# EAGLE design key (EAGLE 9.6.2)
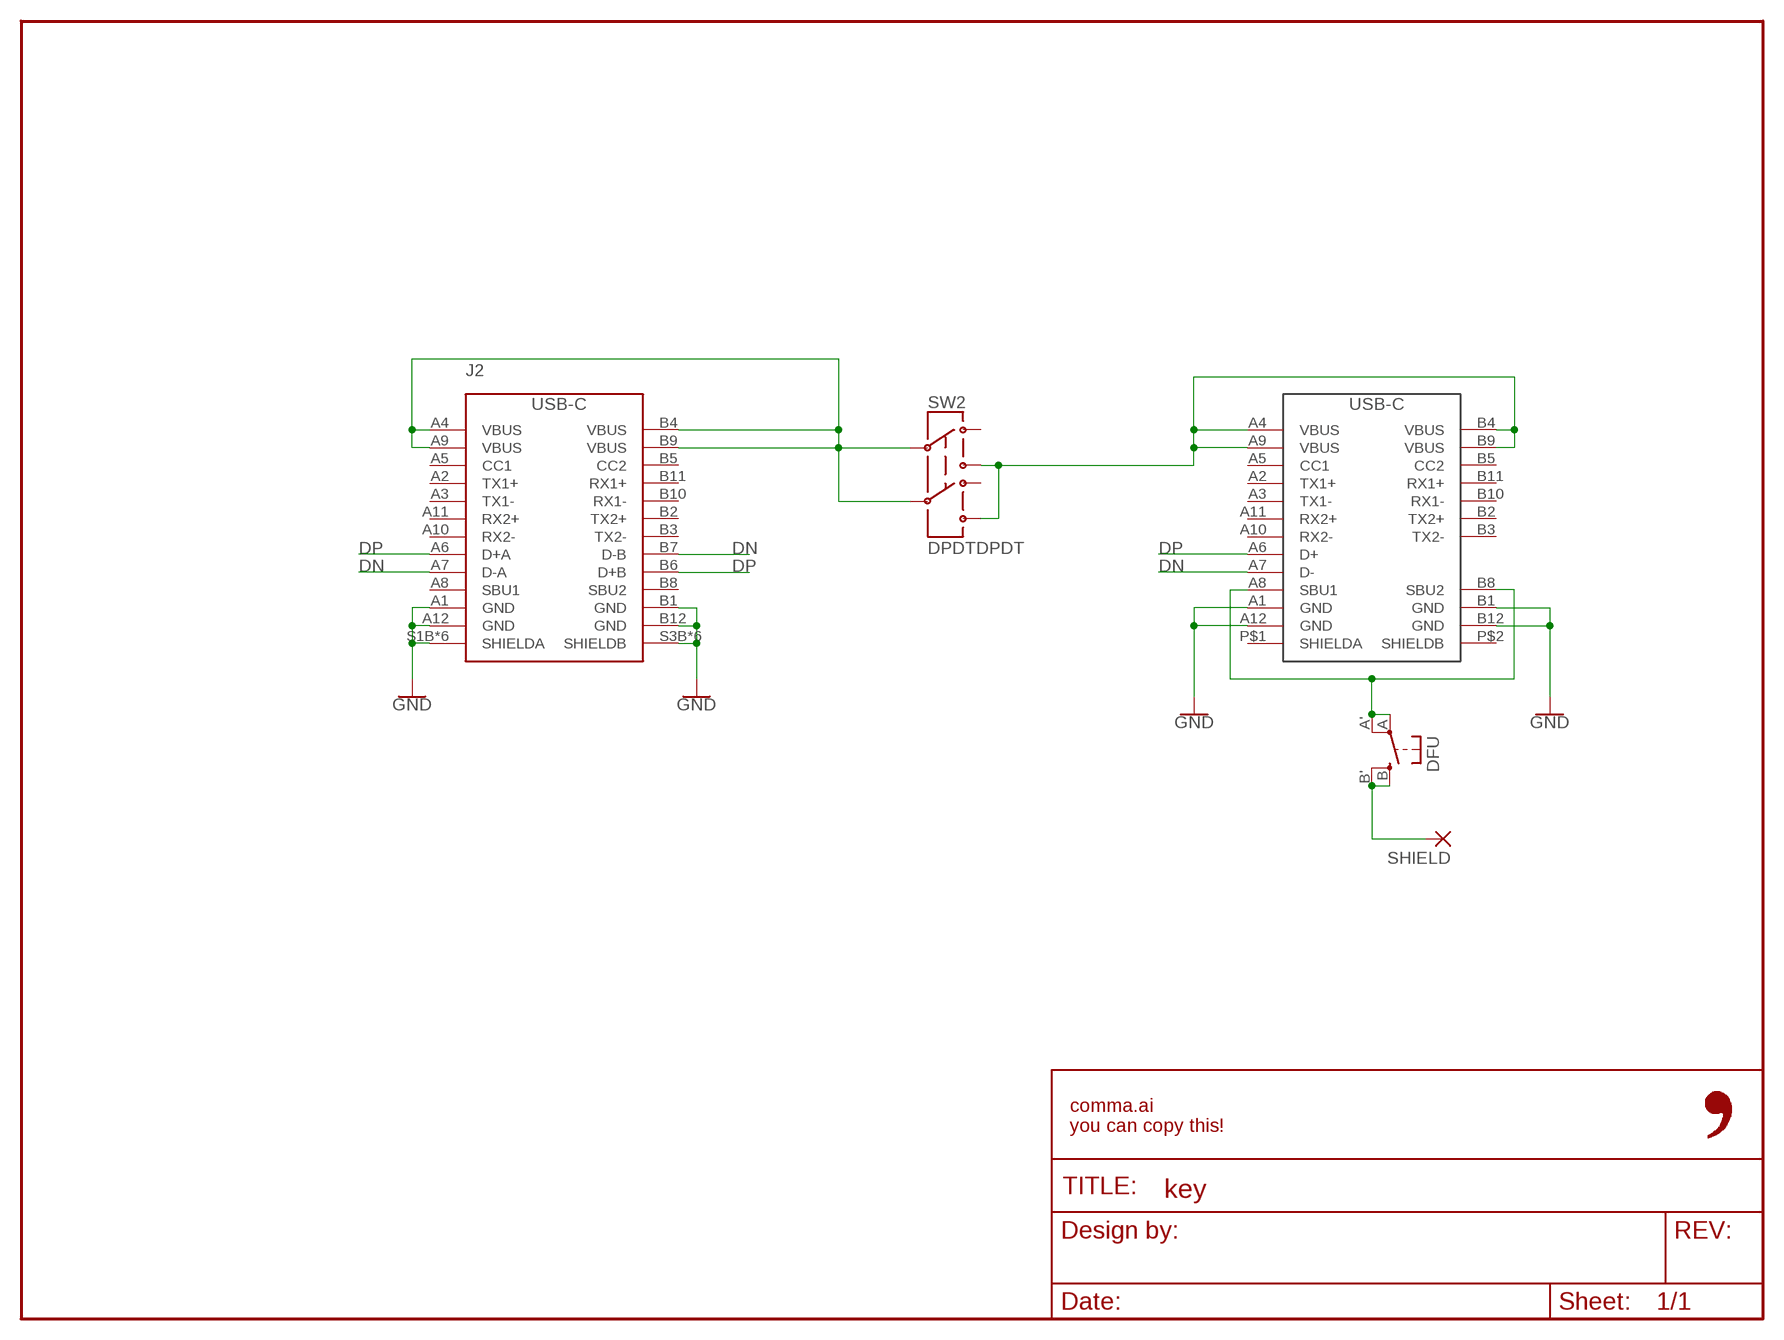
[diagram p0: schematic, sheet 1]

## Parts
DFU  SPST-2-4PIN  [EVQ-Q2]
FRAME1  FRAME-LETTER-OPENNO_PACKAGE  [DUMMY]
J1  USB-C  [USB-C]
J2  USB-C-FEMALE  [DX07S024XJ1R1100]
SHIELD  1,6/0,8  [1,6/0,8]
SW2  DPDTDPDT  [AYZ0202]

## Nets
DN: J1.A7(D-) J2.A7(D-A) J2.B7(D-B)
DP: J1.A6(D+) J2.A6(D+A) J2.B6(D+B)
GND: J1.A1(GND) J1.A12(GND) J1.B1(GND) J1.B12(GND) J2.A1(GND) J2.A12(GND) J2.B1(GND) J2.B12(GND) J2.S1B(SHIELDA) J2.S1T(SHIELDA) J2.S1TH(SHIELDA) J2.S2B(SHIELDA) J2.S2T(SHIELDA) J2.S2TH(SHIELDA) J2.S3B(SHIELDB) J2.S3T(SHIELDB) J2.S3TH(SHIELDB) J2.S4B(SHIELDB) J2.S4T(SHIELDB) J2.S4TH(SHIELDB)
N$2: J1.A4(VBUS) J1.A9(VBUS) J1.B4(VBUS) J1.B9(VBUS) SW2.3 SW2.6
N$3: DFU.A'(P1) DFU.A(P) J1.A8(SBU1) J1.B8(SBU2)
N$4: DFU.B'(S1) DFU.B(S) SHIELD.1(P)
N$5: J2.A4(VBUS) J2.A9(VBUS) J2.B4(VBUS) J2.B9(VBUS) SW2.2 SW2.5
Unconnected: J1.A2(TX1+) J1.A3(TX1-) J1.A5(CC1) J1.A10(RX2-) J1.A11(RX2+) J1.B2(TX2+) J1.B3(TX2-) J1.B5(CC2) J1.B10(RX1-) J1.B11(RX1+) J1.P$1(SHIELDA) J1.P$2(SHIELDB) J2.A2(TX1+) J2.A3(TX1-) J2.A5(CC1) J2.A8(SBU1) J2.A10(RX2-) J2.A11(RX2+) J2.B2(TX2+) J2.B3(TX2-) J2.B5(CC2) J2.B8(SBU2) J2.B10(RX1-) J2.B11(RX1+) SW2.1 SW2.4

## Library data of the parts
DFU = comma.ai:SPST-2; MPN: EVQ-Q2Y03W
FRAME1 = comma.ai:FRAME-LETTER-OPEN: Schematic Frame - Letter Standard 8.5x11 US Letter frame; DESIGNER: Nobody; VERSION: v01
J1 = comma.ai:USB-C; MPN: 10544440001
J2 = comma.ai:USB-C-FEMALE; MPN: DX07S024XJ1R1100
SHIELD = wirepad:1,6/0,8: THROUGH-HOLE PAD
SW2 = comma.ai:DPDT; MPN: JS202011SCQN

## Board
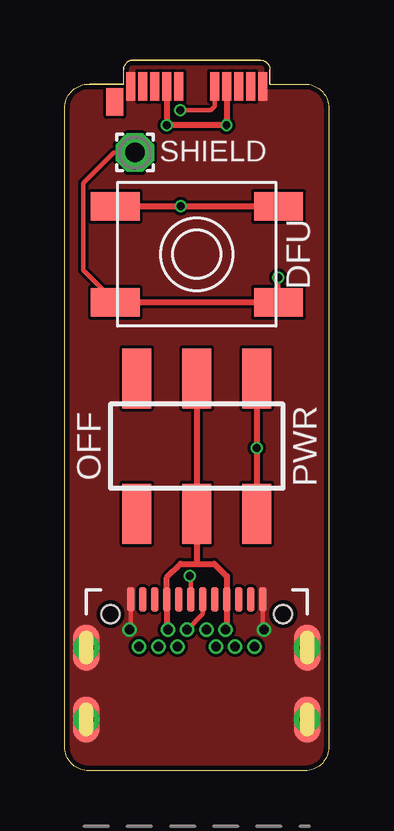
[diagram p1: board, top side]
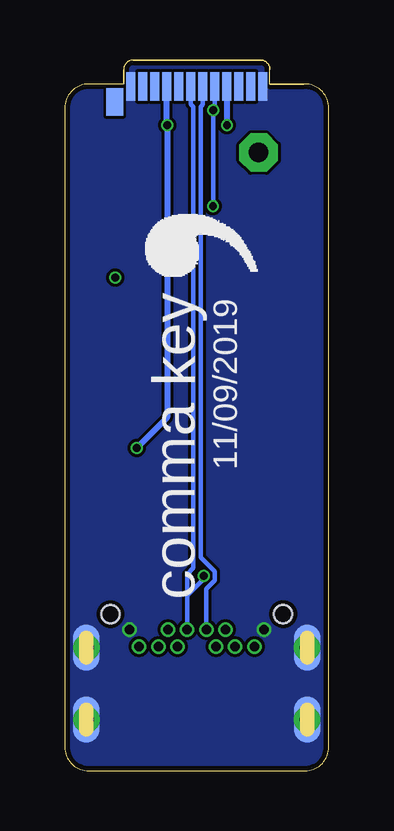
[diagram p2: board, bottom side, seen from below]

Size 11 x 29.64 mm. Coordinates in mm from the lower left corner, seen from the top.
Outline: 11,27.64 11,1 arc-90 10,0 1,0 arc-90 0,1 0,27.64 arc-90 1,28.64 2.45,28.64 2.45,29.24 arc-90 2.85,29.64 8.14,29.64 arc-90 8.54,29.24 8.54,28.64 10,28.64 arc-90 11,27.64
Copper layers (1*16): Top 0.035mm / dielectric 1.5mm / Bottom 0.035mm
Design rules "jlcpcb_2layer": minimum track width 5mil, minimum drill 12mil, track to track 5mil, track to pad 5mil, pad to pad 5mil, via to via 5mil, smd to smd 5mil, copper to edge 8mil, drill to drill 8mil, minimum pad ring 3mil, minimum via ring 3mil, stop-mask expansion 4mm, vias tented up to drill 20mil, thermal gap 10mil

### Footprints (pad centres in the part's own frame; a part is rotated, then mirrored left to right if it is on the bottom)
EVQ-Q2 = smd 2.032 x 1.2: A -3.4,-2; A' 3.4,-2; B -3.4,2; B' 3.4,2
USB-C = smd 0.38 x 1.2: A1 -2.75,0; A2 -2.25,0; A3 -1.75,0; A4 -1.25,0; A5 -0.75,0; A6 -0.25,0; A7 0.25,0; A8 0.75,0; A9 1.25,0; A10 1.75,0; A11 2.25,0; A12 2.75,0 | smd 0.38 x 1.2 bottom: B1 2.75,0; B2 2.25,0; B3 1.75,0; B4 1.25,0; B5 0.75,0; B8 -0.75,0; B9 -1.25,0; B10 -1.75,0; B11 -2.25,0; B12 -2.75,0 | smd 0.7 x 1.15: P$1 -3.42,-0.65 | smd 0.7 x 1.15 bottom: P$2 3.42,-0.65
DX07S024XJ1R1100 = smd 0.3 x 1: A1 -2.75,0.61; A2 -2.25,0.61; A3 -1.75,0.61; A4 -1.25,0.61; A5 -0.75,0.61; A6 -0.25,0.61; A7 0.25,0.61; A8 0.75,0.61; A9 1.25,0.61; A10 1.75,0.61; A11 2.25,0.61; A12 2.75,0.61 | drill 0.4 pad 0.6: B1 2.8,-0.65; B2 2.4,-1.35; B3 1.6,-1.35; B4 1.2,-0.65; B5 0.8,-1.35; B6 0.4,-0.65; B7 -0.4,-0.65; B8 -0.8,-1.35; B9 -1.2,-0.65; B10 -1.6,-1.35; B11 -2.4,-1.35; B12 -2.8,-0.65 | smd 1.1 x 1.9 bottom: S1B -4.6,-1.4; S2B -4.6,-4.4; S3B 4.6,-4.4; S4B 4.6,-1.4 | smd 1.1 x 1.9: S1T -4.6,-1.4; S2T -4.6,-4.4; S3T 4.6,-4.4; S4T 4.6,-1.4 | drill 0.6 pad 1.1: S1TH -4.6,-1.4; S2TH -4.6,-4.4; S3TH 4.6,-4.4; S4TH 4.6,-1.4 | hole 0.75: -3.6,0; 3.6,0
1,6/0,8 = drill 0.813 pad 1.6 octagon: 1 0,0
AYZ0202 = smd 1.2 x 2.5: 1 -2.5,2.825; 2 0,2.825; 3 2.5,2.825; 4 -2.5,-2.825; 5 0,-2.825; 6 2.5,-2.825

### Placement (x,y rotation side)
DFU  5.5,21.54 180 top
FRAME1  -0.64,-2.41 0 top
J1  5.5,28.54 0 bottom
J2  5.5,6.54 0 top
SHIELD  2.92,25.78 0 top
SW2  5.5,13.54 0 top
U$1  [LOGO]  2.67,19.94 90 bottom

### Tracks (layer width: path | path; a pad name or v marks a point on that pad's centre or on a via)
DN
  Top 0.178: J2.A7 5.75,6.54 J2.B7
  Bottom 0.178: J1.A7 5.25,27.77 5.33,27.69 5.33,8.91 4.74,8.32 4.74,7.94 5.1,7.58 J2.B7
DP  (via drill 0.33)
  Top 0.178: J2.A6 5.25,8.09 v5.21,8.13
  Bottom 0.178: v5.21,8.13 5.21,8 5.9,7.31 | 5.9,7.31 J2.B6 | J1.A6 5.75,27.8 5.64,27.69 5.64,8.46 5.9,8.2 5.9,7.31
GND
  Top 0.178: J2.A1 2.75,5.94 J2.B12 | J2.A12 8.25,5.94 J2.B1
  pour Bottom (no thermals): -0.51,30.48 12.95,30.48 12.95,-0.76 -0.51,-0.76
  pour Top (no thermals): -0.64,30.73 13.34,30.73 13.34,-0.89 -0.64,-0.89
N$2  (via drill 0.33)
  Top 0.254: SW2.3 v8,13.46 SW2.6 | J1.B4 4.25,26.93 v4.24,26.92 v6.74,26.92 6.75,26.94 J1.B9
  Bottom 0.254: J1.B4 4.25,26.93 v4.24,26.92 | J1.B9 6.75,26.94 v6.74,26.92 6.74,14.73 v8,13.46
N$3  (via drill 0.33)
  Top 0.178: J1.B8 6.25,27.71 6.09,27.55 v4.82,27.55
  Top 0.254: DFU.A' v4.83,23.54 DFU.A
  Bottom 0.178: J1.A8 4.75,27.61 v4.82,27.55 4.82,23.55 v4.83,23.54
N$4  (via drill 0.33)
  Top 0.178: DFU.B' 0.76,20.88 0.76,24.51 2.03,25.78 SHIELD.1 | v8.89,20.57 v8.9,20.56 DFU.B
  Top 0.254: DFU.B' DFU.B
N$5
  Top 0.254: J2.B9 4.25,5.94 J2.A4 4.25,8.06 4.83,8.64 5.46,8.64 | J2.B4 6.75,5.94 J2.A9 6.75,8.11 6.22,8.64 5.46,8.64 | 5.46,8.64 5.5,8.68 SW2.5 SW2.2

### Text on the board
bPlace: 11/09/2019 | comma key
tNames: OFF | PWR